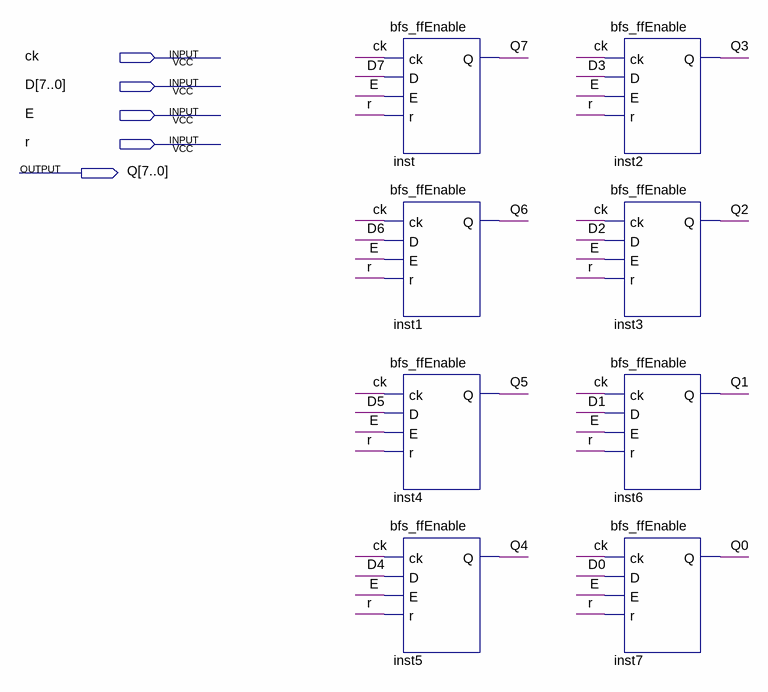
[diagram p0: schematic sheet]
// Quartus schematic bfs_reg_8bits.bdf as structural Verilog: 8 symbols, 5 pins
module bfs_reg_8bits (
  input  ck,
  input  [7:0] D,
  input  E,
  input  r,
  output [7:0] Q
);

  bfs_ffEnable inst (.ck(ck), .D(D[7]), .E(E), .r(r), .Q(Q[7]));
  bfs_ffEnable inst1 (.ck(ck), .D(D[6]), .E(E), .r(r), .Q(Q[6]));
  bfs_ffEnable inst4 (.ck(ck), .D(D[5]), .E(E), .r(r), .Q(Q[5]));
  bfs_ffEnable inst5 (.ck(ck), .D(D[4]), .E(E), .r(r), .Q(Q[4]));
  bfs_ffEnable inst2 (.ck(ck), .D(D[3]), .E(E), .r(r), .Q(Q[3]));
  bfs_ffEnable inst3 (.ck(ck), .D(D[2]), .E(E), .r(r), .Q(Q[2]));
  bfs_ffEnable inst6 (.ck(ck), .D(D[1]), .E(E), .r(r), .Q(Q[1]));
  bfs_ffEnable inst7 (.ck(ck), .D(D[0]), .E(E), .r(r), .Q(Q[0]));
endmodule
